# EAGLE schematic levitator_v1 (2023_05_06 11_59_24 UTC) (EAGLE 9.7.0)
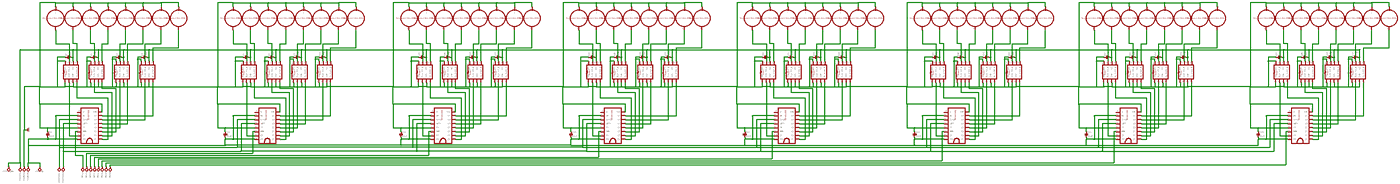
[diagram p0: schematic, sheet 1, overview]
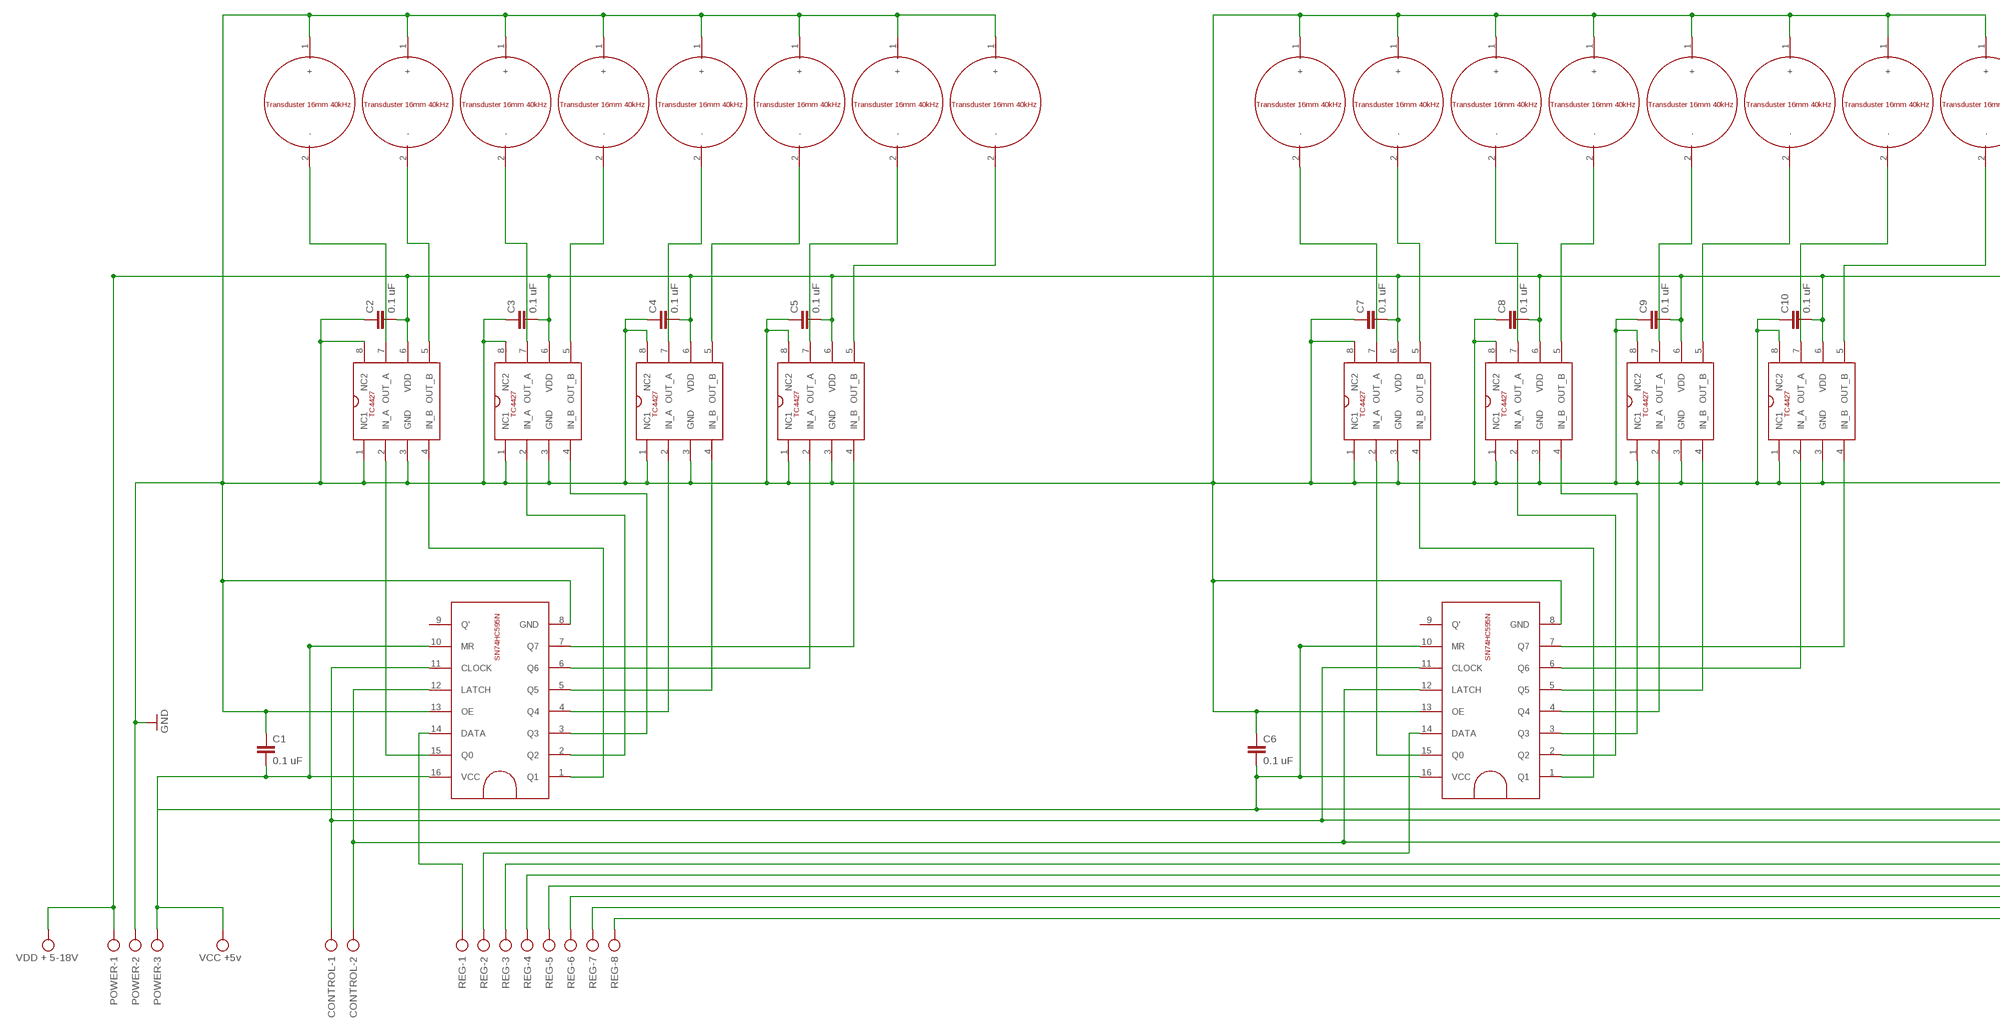
[diagram p1: schematic, sheet 1, part 1 of 4]
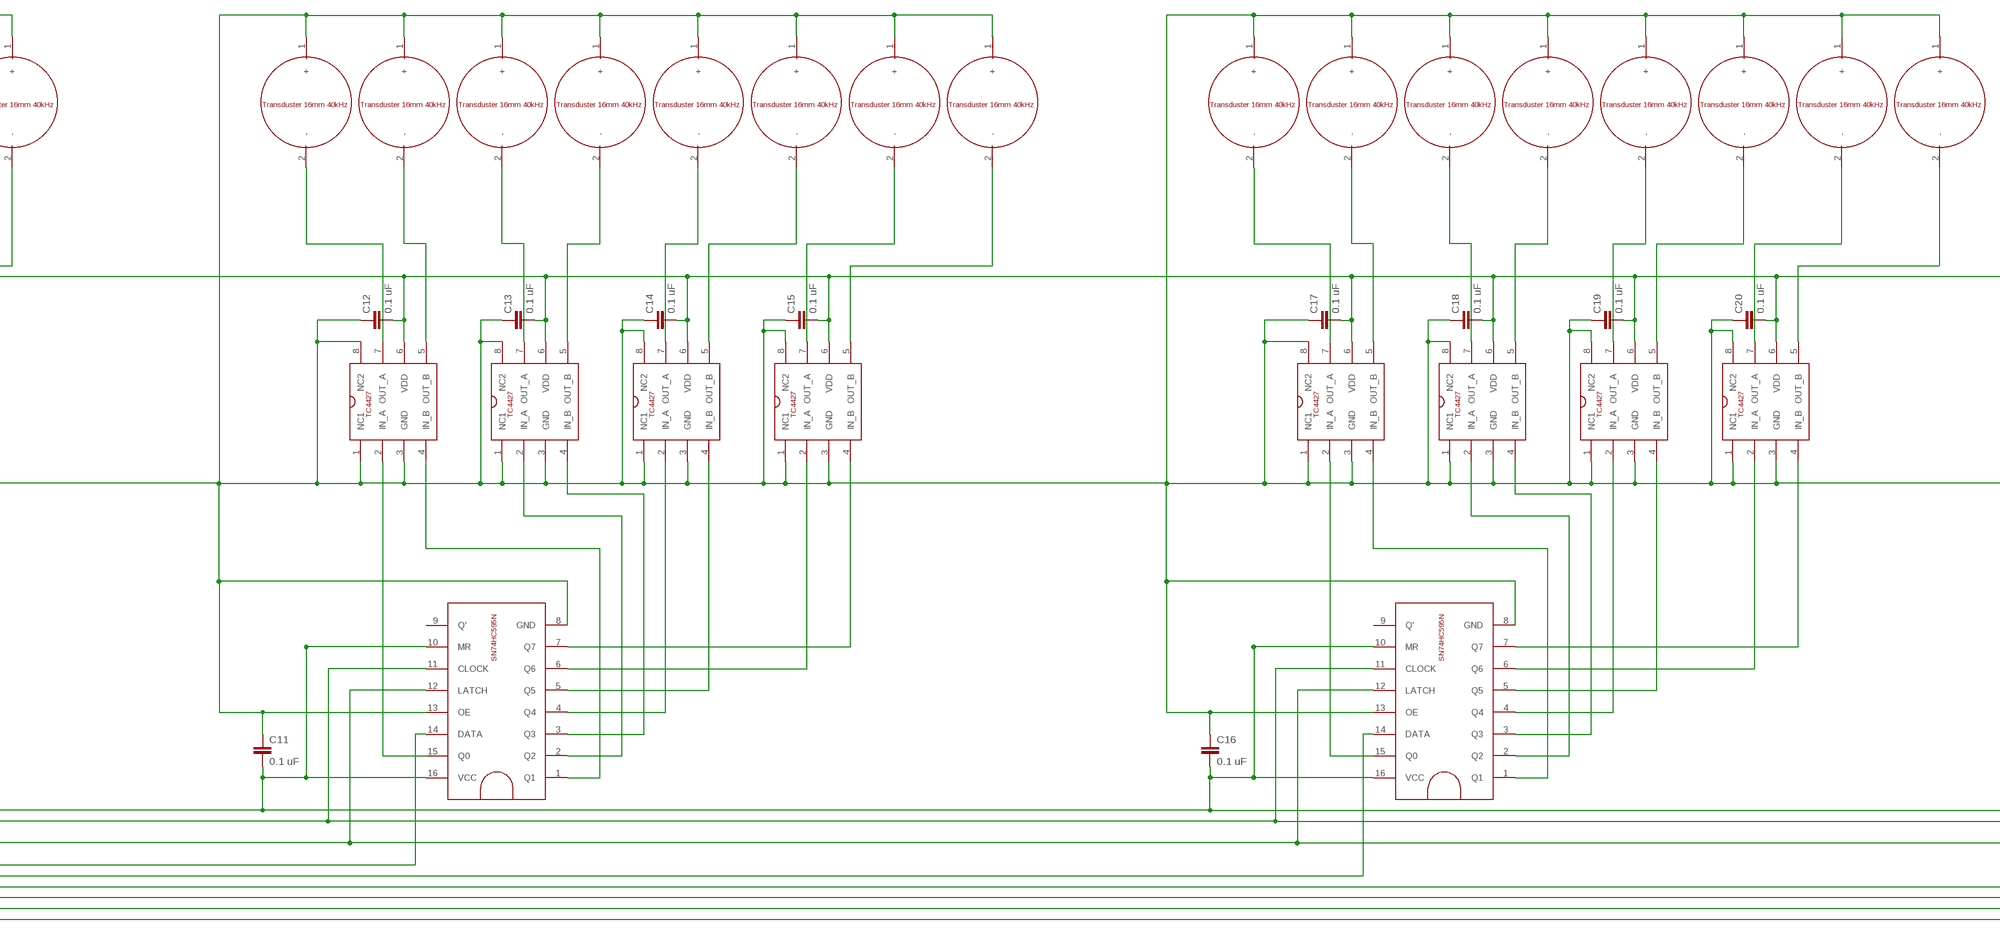
[diagram p2: schematic, sheet 1, part 2 of 4]
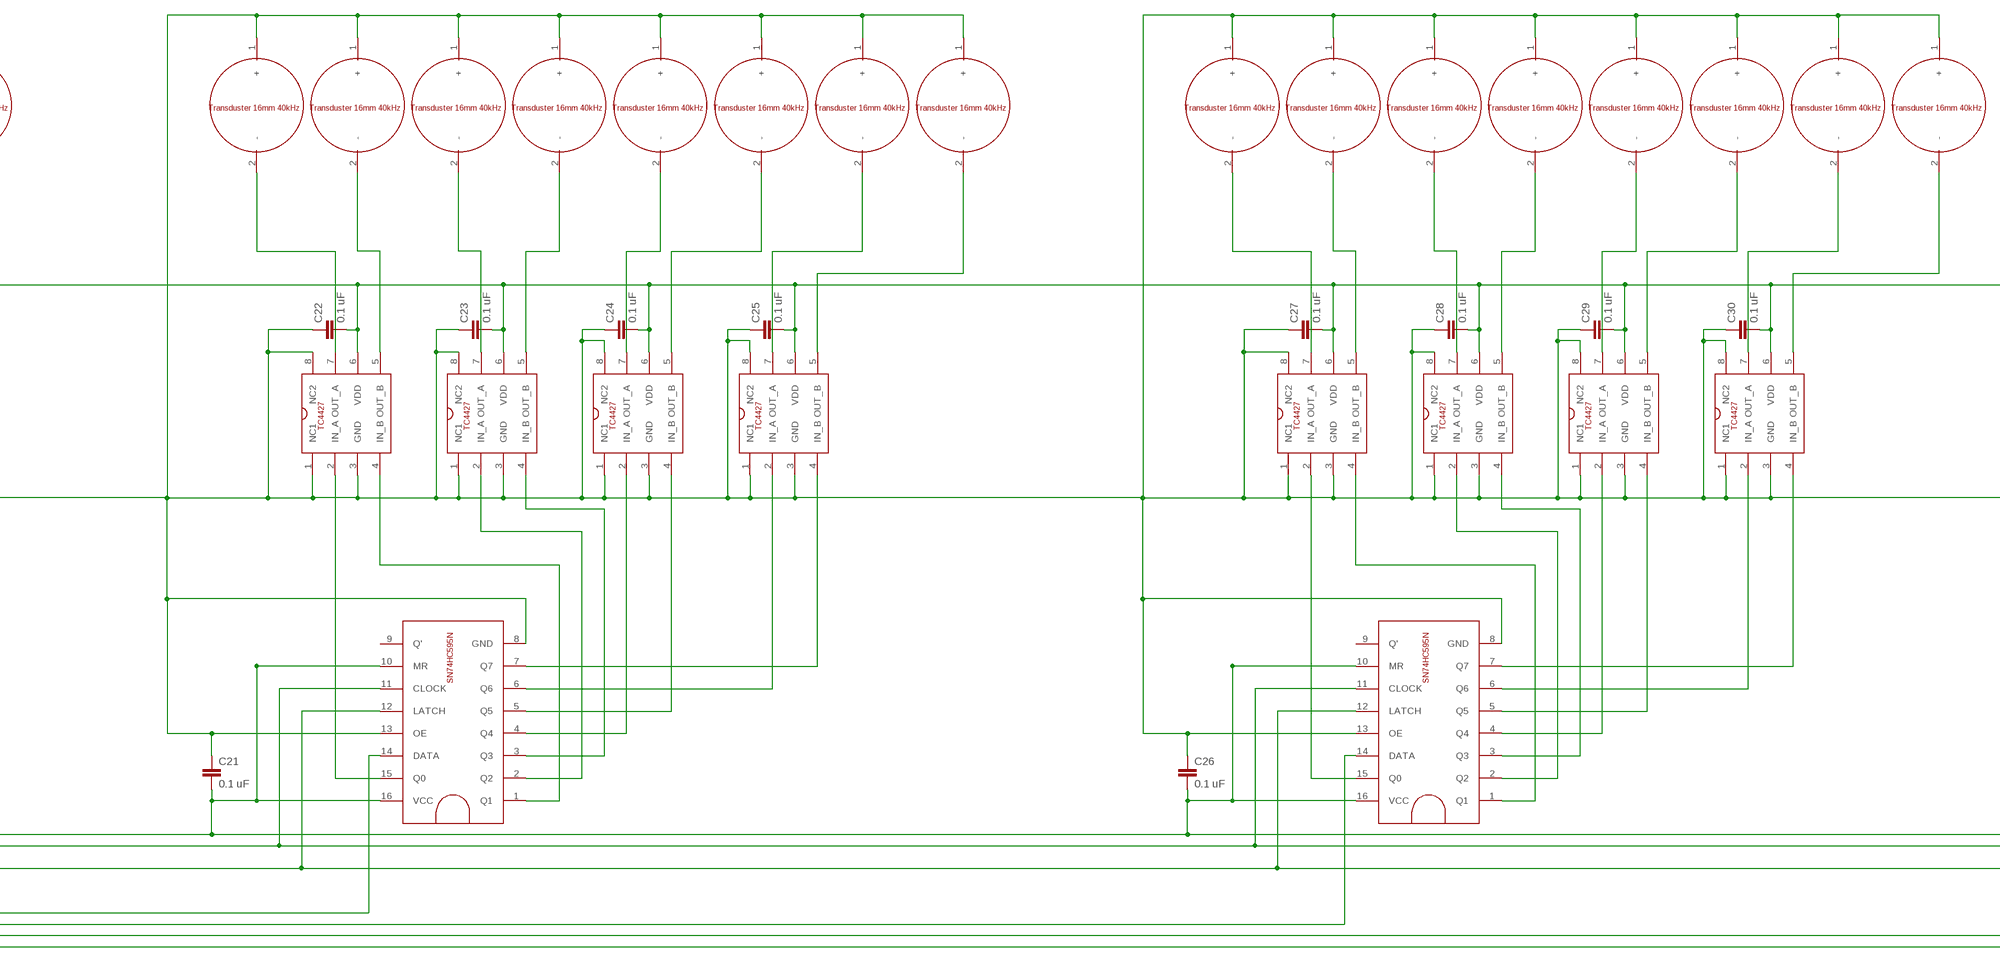
[diagram p3: schematic, sheet 1, part 3 of 4]
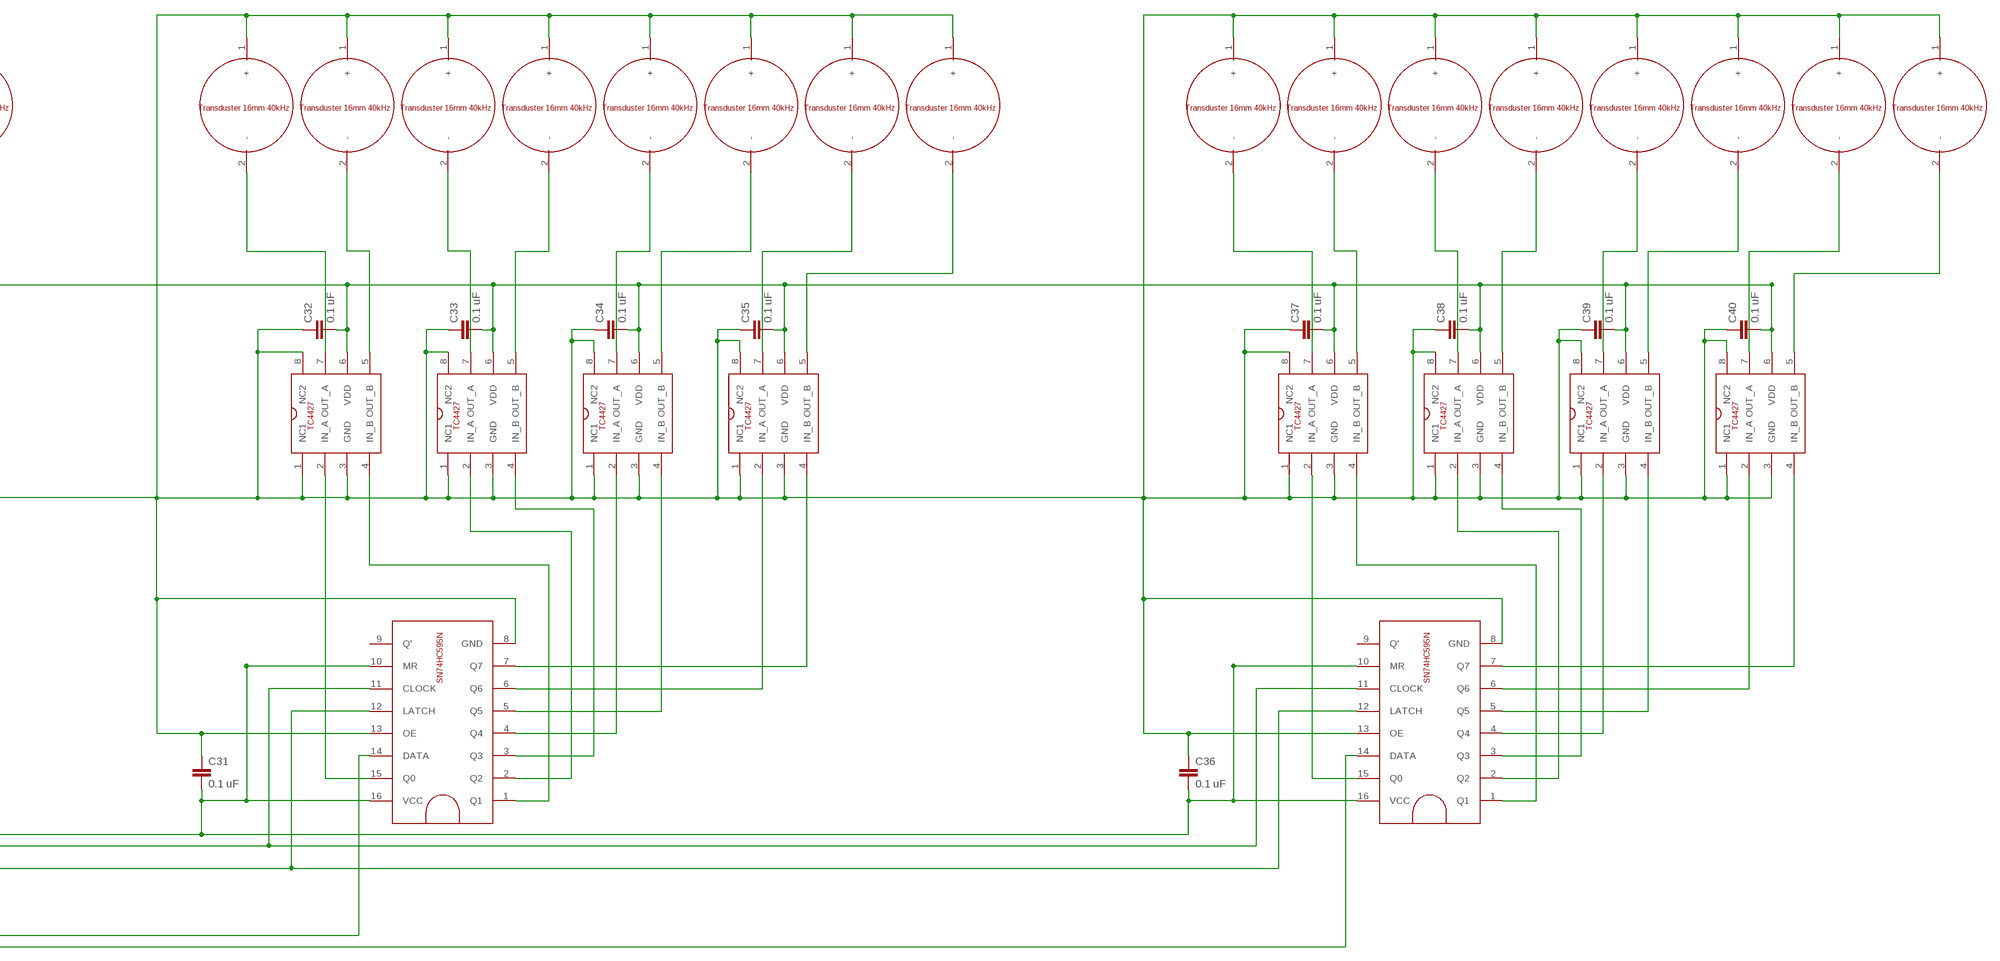
[diagram p4: schematic, sheet 1, part 4 of 4]

## Parts
C1  0.1 uF  C-EU025-025X050  [C025-025X050]
C2  0.1 uF  C-EU025-025X050  [C025-025X050]
C3  0.1 uF  C-EU025-025X050  [C025-025X050]
C4  0.1 uF  C-EU025-025X050  [C025-025X050]
C5  0.1 uF  C-EU025-025X050  [C025-025X050]
C6  0.1 uF  C-EU025-025X050  [C025-025X050]
C7  0.1 uF  C-EU025-025X050  [C025-025X050]
C8  0.1 uF  C-EU025-025X050  [C025-025X050]
C9  0.1 uF  C-EU025-025X050  [C025-025X050]
C10  0.1 uF  C-EU025-025X050  [C025-025X050]
C11  0.1 uF  C-EU025-025X050  [C025-025X050]
C12  0.1 uF  C-EU025-025X050  [C025-025X050]
C13  0.1 uF  C-EU025-025X050  [C025-025X050]
C14  0.1 uF  C-EU025-025X050  [C025-025X050]
C15  0.1 uF  C-EU025-025X050  [C025-025X050]
C16  0.1 uF  C-EU025-025X050  [C025-025X050]
C17  0.1 uF  C-EU025-025X050  [C025-025X050]
C18  0.1 uF  C-EU025-025X050  [C025-025X050]
C19  0.1 uF  C-EU025-025X050  [C025-025X050]
C20  0.1 uF  C-EU025-025X050  [C025-025X050]
C21  0.1 uF  C-EU025-025X050  [C025-025X050]
C22  0.1 uF  C-EU025-025X050  [C025-025X050]
C23  0.1 uF  C-EU025-025X050  [C025-025X050]
C24  0.1 uF  C-EU025-025X050  [C025-025X050]
C25  0.1 uF  C-EU025-025X050  [C025-025X050]
C26  0.1 uF  C-EU025-025X050  [C025-025X050]
C27  0.1 uF  C-EU025-025X050  [C025-025X050]
C28  0.1 uF  C-EU025-025X050  [C025-025X050]
C29  0.1 uF  C-EU025-025X050  [C025-025X050]
C30  0.1 uF  C-EU025-025X050  [C025-025X050]
C31  0.1 uF  C-EU025-025X050  [C025-025X050]
C32  0.1 uF  C-EU025-025X050  [C025-025X050]
C33  0.1 uF  C-EU025-025X050  [C025-025X050]
C34  0.1 uF  C-EU025-025X050  [C025-025X050]
C35  0.1 uF  C-EU025-025X050  [C025-025X050]
C36  0.1 uF  C-EU025-025X050  [C025-025X050]
C37  0.1 uF  C-EU025-025X050  [C025-025X050]
C38  0.1 uF  C-EU025-025X050  [C025-025X050]
C39  0.1 uF  C-EU025-025X050  [C025-025X050]
C40  0.1 uF  C-EU025-025X050  [C025-025X050]
CONTROL  AK500/2-H  [AK500/2-H]
POWER  AK500/3-H  [AK500/3-H]
REG  AK500/8-H  [AK500/8-H]
U$1  TC4427  [TC4427]
U$2  SN74HC595N  [SN74HC595N]
U$3  TC4427  [TC4427]
U$4  TC4427  [TC4427]
U$5  TC4427  [TC4427]
U$6  TRANSDUSTER_16MM_40KHZ  [TRANSDUSTER_16MM_40KHZ]
U$7  TRANSDUSTER_16MM_40KHZ  [TRANSDUSTER_16MM_40KHZ]
U$8  TRANSDUSTER_16MM_40KHZ  [TRANSDUSTER_16MM_40KHZ]
U$9  TRANSDUSTER_16MM_40KHZ  [TRANSDUSTER_16MM_40KHZ]
U$10  TRANSDUSTER_16MM_40KHZ  [TRANSDUSTER_16MM_40KHZ]
U$11  TRANSDUSTER_16MM_40KHZ  [TRANSDUSTER_16MM_40KHZ]
U$12  TRANSDUSTER_16MM_40KHZ  [TRANSDUSTER_16MM_40KHZ]
U$13  TRANSDUSTER_16MM_40KHZ  [TRANSDUSTER_16MM_40KHZ]
U$14  TC4427  [TC4427]
U$15  SN74HC595N  [SN74HC595N]
U$16  TC4427  [TC4427]
U$17  TC4427  [TC4427]
U$18  TC4427  [TC4427]
U$19  TRANSDUSTER_16MM_40KHZ  [TRANSDUSTER_16MM_40KHZ]
U$20  TRANSDUSTER_16MM_40KHZ  [TRANSDUSTER_16MM_40KHZ]
U$21  TRANSDUSTER_16MM_40KHZ  [TRANSDUSTER_16MM_40KHZ]
U$22  TRANSDUSTER_16MM_40KHZ  [TRANSDUSTER_16MM_40KHZ]
U$23  TRANSDUSTER_16MM_40KHZ  [TRANSDUSTER_16MM_40KHZ]
U$24  TRANSDUSTER_16MM_40KHZ  [TRANSDUSTER_16MM_40KHZ]
U$25  TRANSDUSTER_16MM_40KHZ  [TRANSDUSTER_16MM_40KHZ]
U$26  TRANSDUSTER_16MM_40KHZ  [TRANSDUSTER_16MM_40KHZ]
U$27  TC4427  [TC4427]
U$28  SN74HC595N  [SN74HC595N]
U$29  TC4427  [TC4427]
U$30  TC4427  [TC4427]
U$31  TC4427  [TC4427]
U$32  TRANSDUSTER_16MM_40KHZ  [TRANSDUSTER_16MM_40KHZ]
U$33  TRANSDUSTER_16MM_40KHZ  [TRANSDUSTER_16MM_40KHZ]
U$34  TRANSDUSTER_16MM_40KHZ  [TRANSDUSTER_16MM_40KHZ]
U$35  TRANSDUSTER_16MM_40KHZ  [TRANSDUSTER_16MM_40KHZ]
U$36  TRANSDUSTER_16MM_40KHZ  [TRANSDUSTER_16MM_40KHZ]
U$37  TRANSDUSTER_16MM_40KHZ  [TRANSDUSTER_16MM_40KHZ]
U$38  TRANSDUSTER_16MM_40KHZ  [TRANSDUSTER_16MM_40KHZ]
U$39  TRANSDUSTER_16MM_40KHZ  [TRANSDUSTER_16MM_40KHZ]
U$40  TC4427  [TC4427]
U$41  SN74HC595N  [SN74HC595N]
U$42  TC4427  [TC4427]
U$43  TC4427  [TC4427]
U$44  TC4427  [TC4427]
U$45  TRANSDUSTER_16MM_40KHZ  [TRANSDUSTER_16MM_40KHZ]
U$46  TRANSDUSTER_16MM_40KHZ  [TRANSDUSTER_16MM_40KHZ]
U$47  TRANSDUSTER_16MM_40KHZ  [TRANSDUSTER_16MM_40KHZ]
U$48  TRANSDUSTER_16MM_40KHZ  [TRANSDUSTER_16MM_40KHZ]
U$49  TRANSDUSTER_16MM_40KHZ  [TRANSDUSTER_16MM_40KHZ]
U$50  TRANSDUSTER_16MM_40KHZ  [TRANSDUSTER_16MM_40KHZ]
U$51  TRANSDUSTER_16MM_40KHZ  [TRANSDUSTER_16MM_40KHZ]
U$52  TRANSDUSTER_16MM_40KHZ  [TRANSDUSTER_16MM_40KHZ]
U$53  TC4427  [TC4427]
U$54  SN74HC595N  [SN74HC595N]
U$55  TC4427  [TC4427]
U$56  TC4427  [TC4427]
U$57  TC4427  [TC4427]
U$58  TRANSDUSTER_16MM_40KHZ  [TRANSDUSTER_16MM_40KHZ]
U$59  TRANSDUSTER_16MM_40KHZ  [TRANSDUSTER_16MM_40KHZ]
U$60  TRANSDUSTER_16MM_40KHZ  [TRANSDUSTER_16MM_40KHZ]
U$61  TRANSDUSTER_16MM_40KHZ  [TRANSDUSTER_16MM_40KHZ]
U$62  TRANSDUSTER_16MM_40KHZ  [TRANSDUSTER_16MM_40KHZ]
U$63  TRANSDUSTER_16MM_40KHZ  [TRANSDUSTER_16MM_40KHZ]
U$64  TRANSDUSTER_16MM_40KHZ  [TRANSDUSTER_16MM_40KHZ]
U$65  TRANSDUSTER_16MM_40KHZ  [TRANSDUSTER_16MM_40KHZ]
U$66  TC4427  [TC4427]
U$67  SN74HC595N  [SN74HC595N]
U$68  TC4427  [TC4427]
U$69  TC4427  [TC4427]
U$70  TC4427  [TC4427]
U$71  TRANSDUSTER_16MM_40KHZ  [TRANSDUSTER_16MM_40KHZ]
U$72  TRANSDUSTER_16MM_40KHZ  [TRANSDUSTER_16MM_40KHZ]
U$73  TRANSDUSTER_16MM_40KHZ  [TRANSDUSTER_16MM_40KHZ]
U$74  TRANSDUSTER_16MM_40KHZ  [TRANSDUSTER_16MM_40KHZ]
U$75  TRANSDUSTER_16MM_40KHZ  [TRANSDUSTER_16MM_40KHZ]
U$76  TRANSDUSTER_16MM_40KHZ  [TRANSDUSTER_16MM_40KHZ]
U$77  TRANSDUSTER_16MM_40KHZ  [TRANSDUSTER_16MM_40KHZ]
U$78  TRANSDUSTER_16MM_40KHZ  [TRANSDUSTER_16MM_40KHZ]
U$79  TC4427  [TC4427]
U$80  SN74HC595N  [SN74HC595N]
U$81  TC4427  [TC4427]
U$82  TC4427  [TC4427]
U$83  TC4427  [TC4427]
U$84  TRANSDUSTER_16MM_40KHZ  [TRANSDUSTER_16MM_40KHZ]
U$85  TRANSDUSTER_16MM_40KHZ  [TRANSDUSTER_16MM_40KHZ]
U$86  TRANSDUSTER_16MM_40KHZ  [TRANSDUSTER_16MM_40KHZ]
U$87  TRANSDUSTER_16MM_40KHZ  [TRANSDUSTER_16MM_40KHZ]
U$88  TRANSDUSTER_16MM_40KHZ  [TRANSDUSTER_16MM_40KHZ]
U$89  TRANSDUSTER_16MM_40KHZ  [TRANSDUSTER_16MM_40KHZ]
U$90  TRANSDUSTER_16MM_40KHZ  [TRANSDUSTER_16MM_40KHZ]
U$91  TRANSDUSTER_16MM_40KHZ  [TRANSDUSTER_16MM_40KHZ]
U$92  TC4427  [TC4427]
U$93  SN74HC595N  [SN74HC595N]
U$94  TC4427  [TC4427]
U$95  TC4427  [TC4427]
U$96  TC4427  [TC4427]
U$97  TRANSDUSTER_16MM_40KHZ  [TRANSDUSTER_16MM_40KHZ]
U$98  TRANSDUSTER_16MM_40KHZ  [TRANSDUSTER_16MM_40KHZ]
U$99  TRANSDUSTER_16MM_40KHZ  [TRANSDUSTER_16MM_40KHZ]
U$100  TRANSDUSTER_16MM_40KHZ  [TRANSDUSTER_16MM_40KHZ]
U$101  TRANSDUSTER_16MM_40KHZ  [TRANSDUSTER_16MM_40KHZ]
U$102  TRANSDUSTER_16MM_40KHZ  [TRANSDUSTER_16MM_40KHZ]
U$103  TRANSDUSTER_16MM_40KHZ  [TRANSDUSTER_16MM_40KHZ]
U$104  TRANSDUSTER_16MM_40KHZ  [TRANSDUSTER_16MM_40KHZ]

## Nets
GND: C1.1 C2.1 C3.1 C4.1 C5.1 C6.1 C7.1 C8.1 C9.1 C10.1 C11.1 C12.1 C13.1 C14.1 C15.1 C16.1 C17.1 C18.1 C19.1 C20.1 C21.1 C22.1 C23.1 C24.1 C25.1 C26.1 C27.1 C28.1 C29.1 C30.1 C31.1 C32.1 C33.1 C34.1 C35.1 C36.1 C37.1 C38.1 C39.1 C40.1 POWER.2 U$1.1(NC1) U$1.3(GND) U$1.8(NC2) U$2.8(GND) U$2.13(OE) U$3.1(NC1) U$3.3(GND) U$3.8(NC2) U$4.1(NC1) U$4.3(GND) U$4.8(NC2) U$5.1(NC1) U$5.3(GND) U$5.8(NC2) U$6.1(+) U$7.1(+) U$8.1(+) U$9.1(+) U$10.1(+) U$11.1(+) U$12.1(+) U$13.1(+) U$14.1(NC1) U$14.3(GND) U$14.8(NC2) U$15.8(GND) U$15.13(OE) U$16.1(NC1) U$16.3(GND) U$16.8(NC2) U$17.1(NC1) U$17.3(GND) U$17.8(NC2) U$18.1(NC1) U$18.3(GND) U$18.8(NC2) U$19.1(+) U$20.1(+) U$21.1(+) U$22.1(+) U$23.1(+) U$24.1(+) U$25.1(+) U$26.1(+) U$27.1(NC1) U$27.3(GND) U$27.8(NC2) U$28.8(GND) U$28.13(OE) U$29.1(NC1) U$29.3(GND) U$29.8(NC2) U$30.1(NC1) U$30.3(GND) U$30.8(NC2) U$31.1(NC1) U$31.3(GND) U$31.8(NC2) U$32.1(+) U$33.1(+) U$34.1(+) U$35.1(+) U$36.1(+) U$37.1(+) U$38.1(+) U$39.1(+) U$40.1(NC1) U$40.3(GND) U$40.8(NC2) U$41.8(GND) U$41.13(OE) U$42.1(NC1) U$42.3(GND) U$42.8(NC2) U$43.1(NC1) U$43.3(GND) U$43.8(NC2) U$44.1(NC1) U$44.3(GND) U$44.8(NC2) U$45.1(+) U$46.1(+) U$47.1(+) U$48.1(+) U$49.1(+) U$50.1(+) U$51.1(+) U$52.1(+) U$53.1(NC1) U$53.3(GND) U$53.8(NC2) U$54.8(GND) U$54.13(OE) U$55.1(NC1) U$55.3(GND) U$55.8(NC2) U$56.1(NC1) U$56.3(GND) U$56.8(NC2) U$57.1(NC1) U$57.3(GND) U$57.8(NC2) U$58.1(+) U$59.1(+) U$60.1(+) U$61.1(+) U$62.1(+) U$63.1(+) U$64.1(+) U$65.1(+) U$66.1(NC1) U$66.3(GND) U$66.8(NC2) U$67.8(GND) U$67.13(OE) U$68.1(NC1) U$68.3(GND) U$68.8(NC2) U$69.1(NC1) U$69.3(GND) U$69.8(NC2) U$70.1(NC1) U$70.3(GND) U$70.8(NC2) U$71.1(+) U$72.1(+) U$73.1(+) U$74.1(+) U$75.1(+) U$76.1(+) U$77.1(+) U$78.1(+) U$79.1(NC1) U$79.3(GND) U$79.8(NC2) U$80.8(GND) U$80.13(OE) U$81.1(NC1) U$81.3(GND) U$81.8(NC2) U$82.1(NC1) U$82.3(GND) U$82.8(NC2) U$83.1(NC1) U$83.3(GND) U$83.8(NC2) U$84.1(+) U$85.1(+) U$86.1(+) U$87.1(+) U$88.1(+) U$89.1(+) U$90.1(+) U$91.1(+) U$92.1(NC1) U$92.3(GND) U$92.8(NC2) U$93.8(GND) U$93.13(OE) U$94.1(NC1) U$94.3(GND) U$94.8(NC2) U$95.1(NC1) U$95.3(GND) U$95.8(NC2) U$96.1(NC1) U$96.3(GND) U$96.8(NC2) U$97.1(+) U$98.1(+) U$99.1(+) U$100.1(+) U$101.1(+) U$102.1(+) U$103.1(+) U$104.1(+)
N$1: U$1.2(IN_A) U$2.15(Q0)
N$2: U$1.4(IN_B) U$2.1(Q1)
N$3: U$2.2(Q2) U$3.2(IN_A)
N$4: U$2.3(Q3) U$3.4(IN_B)
N$5: U$2.4(Q4) U$4.2(IN_A)
N$6: U$2.5(Q5) U$4.4(IN_B)
N$7: U$2.6(Q6) U$5.2(IN_A)
N$8: U$2.7(Q7) U$5.4(IN_B)
N$9: U$1.7(OUT_A) U$6.2(-)
N$10: U$1.5(OUT_B) U$7.2(-)
N$11: U$3.7(OUT_A) U$8.2(-)
N$12: U$3.5(OUT_B) U$9.2(-)
N$13: U$4.7(OUT_A) U$10.2(-)
N$14: U$4.5(OUT_B) U$11.2(-)
N$15: U$5.7(OUT_A) U$12.2(-)
N$16: U$5.5(OUT_B) U$13.2(-)
N$17: REG.1 U$2.14(DATA)
N$18: U$79.2(IN_A) U$80.15(Q0)
N$19: U$79.4(IN_B) U$80.1(Q1)
N$20: U$14.2(IN_A) U$15.15(Q0)
N$21: U$14.4(IN_B) U$15.1(Q1)
N$22: U$15.2(Q2) U$16.2(IN_A)
N$23: U$15.3(Q3) U$16.4(IN_B)
N$24: U$15.4(Q4) U$17.2(IN_A)
N$25: U$15.5(Q5) U$17.4(IN_B)
N$26: U$15.6(Q6) U$18.2(IN_A)
N$27: U$15.7(Q7) U$18.4(IN_B)
N$28: U$14.7(OUT_A) U$19.2(-)
N$29: U$14.5(OUT_B) U$20.2(-)
N$30: U$16.7(OUT_A) U$21.2(-)
N$31: U$16.5(OUT_B) U$22.2(-)
N$32: U$17.7(OUT_A) U$23.2(-)
N$33: U$17.5(OUT_B) U$24.2(-)
N$34: U$18.7(OUT_A) U$25.2(-)
N$35: U$18.5(OUT_B) U$26.2(-)
N$36: REG.2 U$15.14(DATA)
N$39: U$27.2(IN_A) U$28.15(Q0)
N$40: U$27.4(IN_B) U$28.1(Q1)
N$41: U$28.2(Q2) U$29.2(IN_A)
N$42: U$28.3(Q3) U$29.4(IN_B)
N$43: U$28.4(Q4) U$30.2(IN_A)
N$44: U$28.5(Q5) U$30.4(IN_B)
N$45: U$28.6(Q6) U$31.2(IN_A)
N$46: U$28.7(Q7) U$31.4(IN_B)
N$47: U$27.7(OUT_A) U$32.2(-)
N$48: U$27.5(OUT_B) U$33.2(-)
N$49: U$29.7(OUT_A) U$34.2(-)
N$50: U$29.5(OUT_B) U$35.2(-)
N$51: U$30.7(OUT_A) U$36.2(-)
N$52: U$30.5(OUT_B) U$37.2(-)
N$53: U$31.7(OUT_A) U$38.2(-)
N$54: U$31.5(OUT_B) U$39.2(-)
N$55: REG.3 U$28.14(DATA)
N$56: U$80.2(Q2) U$81.2(IN_A)
N$57: CONTROL.1 U$2.11(CLOCK) U$15.11(CLOCK) U$28.11(CLOCK) U$41.11(CLOCK) U$54.11(CLOCK) U$67.11(CLOCK) U$80.11(CLOCK) U$93.11(CLOCK)
N$58: CONTROL.2 U$2.12(LATCH) U$15.12(LATCH) U$28.12(LATCH) U$41.12(LATCH) U$54.12(LATCH) U$67.12(LATCH) U$80.12(LATCH) U$93.12(LATCH)
N$59: U$40.2(IN_A) U$41.15(Q0)
N$60: U$40.4(IN_B) U$41.1(Q1)
N$61: U$41.2(Q2) U$42.2(IN_A)
N$62: U$41.3(Q3) U$42.4(IN_B)
N$63: U$41.4(Q4) U$43.2(IN_A)
N$64: U$41.5(Q5) U$43.4(IN_B)
N$65: U$41.6(Q6) U$44.2(IN_A)
N$66: U$41.7(Q7) U$44.4(IN_B)
N$67: U$40.7(OUT_A) U$45.2(-)
N$68: U$40.5(OUT_B) U$46.2(-)
N$69: U$42.7(OUT_A) U$47.2(-)
N$70: U$42.5(OUT_B) U$48.2(-)
N$71: U$43.7(OUT_A) U$49.2(-)
N$72: U$43.5(OUT_B) U$50.2(-)
N$73: U$44.7(OUT_A) U$51.2(-)
N$74: U$44.5(OUT_B) U$52.2(-)
N$75: REG.4 U$41.14(DATA)
N$76: U$80.3(Q3) U$81.4(IN_B)
N$79: U$53.2(IN_A) U$54.15(Q0)
N$80: U$53.4(IN_B) U$54.1(Q1)
N$81: U$54.2(Q2) U$55.2(IN_A)
N$82: U$54.3(Q3) U$55.4(IN_B)
N$83: U$54.4(Q4) U$56.2(IN_A)
N$84: U$54.5(Q5) U$56.4(IN_B)
N$85: U$54.6(Q6) U$57.2(IN_A)
N$86: U$54.7(Q7) U$57.4(IN_B)
N$87: U$53.7(OUT_A) U$58.2(-)
N$88: U$53.5(OUT_B) U$59.2(-)
N$89: U$55.7(OUT_A) U$60.2(-)
N$90: U$55.5(OUT_B) U$61.2(-)
N$91: U$56.7(OUT_A) U$62.2(-)
N$92: U$56.5(OUT_B) U$63.2(-)
N$93: U$57.7(OUT_A) U$64.2(-)
N$94: U$57.5(OUT_B) U$65.2(-)
N$95: REG.5 U$54.14(DATA)
N$98: U$66.2(IN_A) U$67.15(Q0)
N$99: U$66.4(IN_B) U$67.1(Q1)
N$100: U$67.2(Q2) U$68.2(IN_A)
N$101: U$67.3(Q3) U$68.4(IN_B)
N$102: U$67.4(Q4) U$69.2(IN_A)
N$103: U$67.5(Q5) U$69.4(IN_B)
N$104: U$67.6(Q6) U$70.2(IN_A)
N$105: U$67.7(Q7) U$70.4(IN_B)
N$106: U$66.7(OUT_A) U$71.2(-)
N$107: U$66.5(OUT_B) U$72.2(-)
N$108: U$68.7(OUT_A) U$73.2(-)
N$109: U$68.5(OUT_B) U$74.2(-)
N$110: U$69.7(OUT_A) U$75.2(-)
N$111: U$69.5(OUT_B) U$76.2(-)
N$112: U$70.7(OUT_A) U$77.2(-)
N$113: U$70.5(OUT_B) U$78.2(-)
N$114: REG.6 U$67.14(DATA)
N$115: U$80.4(Q4) U$82.2(IN_A)
N$116: U$80.5(Q5) U$82.4(IN_B)
N$117: U$80.6(Q6) U$83.2(IN_A)
N$118: U$80.7(Q7) U$83.4(IN_B)
N$119: U$79.7(OUT_A) U$84.2(-)
N$120: U$79.5(OUT_B) U$85.2(-)
N$121: U$81.7(OUT_A) U$86.2(-)
N$122: U$81.5(OUT_B) U$87.2(-)
N$123: U$82.7(OUT_A) U$88.2(-)
N$124: U$82.5(OUT_B) U$89.2(-)
N$125: U$83.7(OUT_A) U$90.2(-)
N$126: U$83.5(OUT_B) U$91.2(-)
N$127: REG.7 U$80.14(DATA)
N$130: U$92.2(IN_A) U$93.15(Q0)
N$131: U$92.4(IN_B) U$93.1(Q1)
N$132: U$93.2(Q2) U$94.2(IN_A)
N$133: U$93.3(Q3) U$94.4(IN_B)
N$134: U$93.4(Q4) U$95.2(IN_A)
N$135: U$93.5(Q5) U$95.4(IN_B)
N$136: U$93.6(Q6) U$96.2(IN_A)
N$137: U$93.7(Q7) U$96.4(IN_B)
N$138: U$92.7(OUT_A) U$97.2(-)
N$139: U$92.5(OUT_B) U$98.2(-)
N$140: U$94.7(OUT_A) U$99.2(-)
N$141: U$94.5(OUT_B) U$100.2(-)
N$142: U$95.7(OUT_A) U$101.2(-)
N$143: U$95.5(OUT_B) U$102.2(-)
N$144: U$96.7(OUT_A) U$103.2(-)
N$145: U$96.5(OUT_B) U$104.2(-)
N$146: REG.8 U$93.14(DATA)
VCC: C1.2 C6.2 C11.2 C16.2 C21.2 C26.2 C31.2 C36.2 POWER.3 U$2.10(MR) U$2.16(VCC) U$15.10(MR) U$15.16(VCC) U$28.10(MR) U$28.16(VCC) U$41.10(MR) U$41.16(VCC) U$54.10(MR) U$54.16(VCC) U$67.10(MR) U$67.16(VCC) U$80.10(MR) U$80.16(VCC) U$93.10(MR) U$93.16(VCC) ; supply symbol labelled VCC +5v
VDD: C2.2 C3.2 C4.2 C5.2 C7.2 C8.2 C9.2 C10.2 C12.2 C13.2 C14.2 C15.2 C17.2 C18.2 C19.2 C20.2 C22.2 C23.2 C24.2 C25.2 C27.2 C28.2 C29.2 C30.2 C32.2 C33.2 C34.2 C35.2 C37.2 C38.2 C39.2 C40.2 POWER.1 U$1.6(VDD) U$3.6(VDD) U$4.6(VDD) U$5.6(VDD) U$14.6(VDD) U$16.6(VDD) U$17.6(VDD) U$18.6(VDD) U$27.6(VDD) U$29.6(VDD) U$30.6(VDD) U$31.6(VDD) U$40.6(VDD) U$42.6(VDD) U$43.6(VDD) U$44.6(VDD) U$53.6(VDD) U$55.6(VDD) U$56.6(VDD) U$57.6(VDD) U$66.6(VDD) U$68.6(VDD) U$69.6(VDD) U$70.6(VDD) U$79.6(VDD) U$81.6(VDD) U$82.6(VDD) U$83.6(VDD) U$92.6(VDD) U$94.6(VDD) U$95.6(VDD) U$96.6(VDD) ; supply symbol labelled VDD + 5-18V
Unconnected: U$2.9(Q') U$15.9(Q') U$28.9(Q') U$41.9(Q') U$54.9(Q') U$67.9(Q') U$80.9(Q') U$93.9(Q')

## Library data of the parts
C1-C40 = rcl:C-EU: CAPACITOR, European symbol; SPICEPREFIX: C
CONTROL = con-ptr500:AK500/2-H: CONNECTOR Aug. 2004 / PTR Meßtechnik: Die Bezeichnung der Serie AK505 wurde geändert. Es handelt sich hierbei um AK500 in horizontaler Ausführung.; OC_FARNELL: unknown; OC_NEWARK: unknown
POWER = con-ptr500:AK500/3-H: CONNECTOR Aug. 2004 / PTR Meßtechnik: Die Bezeichnung der Serie AK505 wurde geändert. Es handelt sich hierbei um AK500 in horizontaler Ausführung.; OC_FARNELL: unknown; OC_NEWARK: unknown
REG = con-ptr500:AK500/8-H: CONNECTOR Aug. 2004 / PTR Meßtechnik: Die Bezeichnung der Serie AK505 wurde geändert. Es handelt sich hierbei um AK500 in horizontaler Ausführung.; OC_FARNELL: unknown; OC_NEWARK: unknown
U$1 U$3-U$5 U$14 U$16-U$18 U$27 U$29-U$31 U$40 U$42-U$44 U$53 U$55-U$57 U$66 U$68-U$70 U$79 U$81-U$83 U$92 U$94-U$96 = TC4427:TC4427
U$2 U$15 U$28 U$41 U$54 U$67 U$80 U$93 = TC4427:SN74HC595N
U$6-U$13 U$19-U$26 U$32-U$39 U$45-U$52 U$58-U$65 U$71-U$78 U$84-U$91 U$97-U$104 = TC4427:TRANSDUSTER_16MM_40KHZ